# EAGLE schematic SchematicSketchFinal (EAGLE 7.6.0)
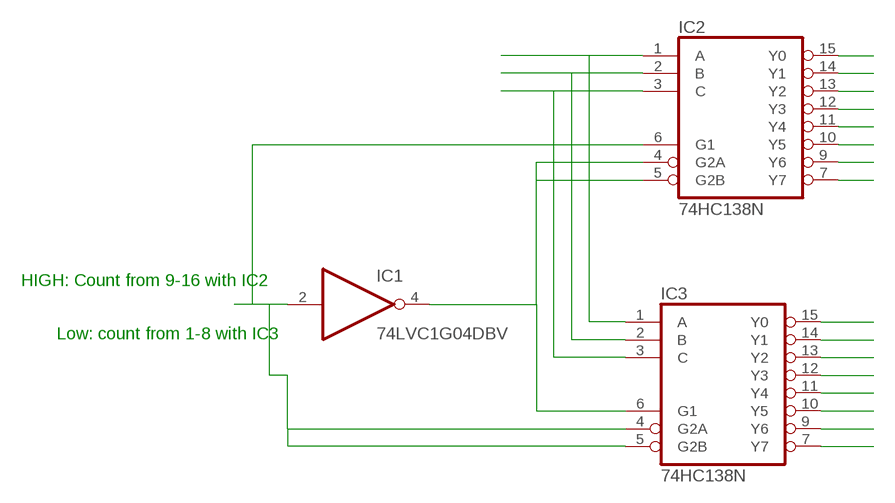
[diagram p0: schematic, sheet 1]

## Parts
IC1  74LVC1G04DBV  [SOT23-5]
IC2  74HC138N  [DIL16]
IC3  74HC138N  [DIL16]

## Nets
N$1: IC1.4(O) IC2.4(G2A) IC2.5(G2B) IC3.6(G1)
N$3: IC3.15(Y0)
N$5: IC1.2(I) IC2.6(G1) IC3.4(G2A) IC3.5(G2B)
N$7: IC2.1(A) IC3.1(A)
N$8: IC2.2(B) IC3.2(B)
N$9: IC2.3(C) IC3.3(C)
N$10: IC2.15(Y0)
N$11: IC2.14(Y1)
N$12: IC2.13(Y2)
N$13: IC2.12(Y3)
N$14: IC2.11(Y4)
N$15: IC2.10(Y5)
N$16: IC2.9(Y6)
N$17: IC2.7(Y7)
N$18: IC3.14(Y1)
N$19: IC3.13(Y2)
N$20: IC3.12(Y3)
N$21: IC3.11(Y4)
N$22: IC3.10(Y5)
N$23: IC3.9(Y6)
N$24: IC3.7(Y7)

## Notes on the sheet
- HIGH: Count from 9-16 with IC2
- Low: count from 1-8 with IC3

## Power pins joined to a net without a drawn wire
GND: IC1.3(GND) IC2.8(GND) IC3.8(GND)
VCC: IC1.5(VCC) IC2.16(VCC) IC3.16(VCC)

## Library data of the parts
IC1 = 74xx-little-us:74*1G04: INVERTER Gate
IC2 IC3 = 74xx-eu:74*138: 3-line to 8-line DECODER/DEMULTIPLEXER